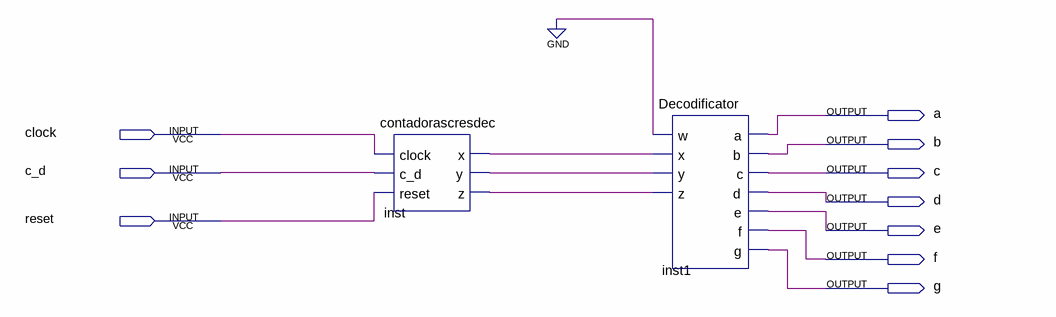
[diagram p0: schematic sheet]
// Quartus schematic Circuitofinal.bdf as structural Verilog: 2 symbols, 10 pins
module Circuitofinal (
  input  clock,
  input  c_d,
  input  reset,
  output a,
  output b,
  output c,
  output d,
  output e,
  output f,
  output g
);

  wire inst_x, inst_y, inst_z;

  contadorascresdec inst (.clock(clock), .c_d(c_d), .reset(reset), .x(inst_x), .y(inst_y), .z(inst_z));
  Decodificator inst1 (.w(1'b0), .x(inst_x), .y(inst_y), .z(inst_z), .a(a), .b(b), .c(c), .d(d), .e(e), .f(f), .g(g));
endmodule
